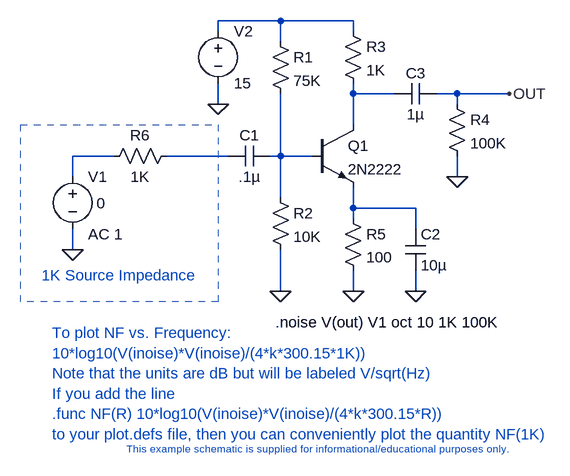
[diagram p0: schematic NoiseFigure.asc]
NoiseFigure.asc, the LTspice schematic file:
Version 4
SHEET 1 3088 1688
WIRE 1888 896 1792 896
WIRE 2000 896 1888 896
WIRE 1792 912 1792 896
WIRE 2000 912 2000 896
WIRE 1888 928 1888 896
WIRE 2000 1008 2000 992
WIRE 2064 1008 2000 1008
WIRE 2160 1008 2128 1008
WIRE 2240 1008 2160 1008
WIRE 1792 1024 1792 992
WIRE 2160 1024 2160 1008
WIRE 2000 1056 2000 1008
WIRE 1632 1104 1568 1104
WIRE 1808 1104 1712 1104
WIRE 1888 1104 1888 1008
WIRE 1888 1104 1872 1104
WIRE 1936 1104 1888 1104
WIRE 1568 1136 1568 1104
WIRE 2160 1136 2160 1104
WIRE 1888 1168 1888 1104
WIRE 2000 1184 2000 1152
WIRE 2096 1184 2000 1184
WIRE 2000 1200 2000 1184
WIRE 2096 1216 2096 1184
WIRE 1568 1248 1568 1216
WIRE 1888 1312 1888 1248
WIRE 2000 1312 2000 1280
WIRE 2096 1312 2096 1280
FLAG 1792 1024 0
FLAG 1568 1248 0
FLAG 2240 1008 OUT
FLAG 2000 1312 0
FLAG 1888 1312 0
FLAG 2096 1312 0
FLAG 2160 1136 0
SYMBOL voltage 1792 896 R0
SYMATTR InstName V2
SYMATTR Value 15
SYMBOL voltage 1568 1120 R0
WINDOW 3 37 57 Left 2
WINDOW 123 24 104 Left 2
SYMATTR Value 0
SYMATTR Value2 AC 1
SYMATTR InstName V1
SYMBOL npn 1936 1056 R0
SYMATTR InstName Q1
SYMATTR Value 2N2222
SYMBOL res 1984 896 R0
SYMATTR InstName R3
SYMATTR Value 1K
SYMBOL res 1984 1184 R0
SYMATTR InstName R5
SYMATTR Value 100
SYMBOL res 1872 912 R0
SYMATTR InstName R1
SYMATTR Value 75K
SYMBOL res 1872 1152 R0
SYMATTR InstName R2
SYMATTR Value 10K
SYMBOL cap 1872 1088 R90
WINDOW 0 0 32 VBottom 2
WINDOW 3 32 32 VTop 2
SYMATTR InstName C1
SYMATTR Value .1µ
SYMBOL cap 2080 1216 R0
SYMATTR InstName C2
SYMATTR Value 10µ
SYMBOL res 2144 1008 R0
SYMATTR InstName R4
SYMATTR Value 100K
SYMBOL cap 2128 992 R90
WINDOW 0 0 32 VBottom 2
WINDOW 3 32 32 VTop 2
SYMATTR InstName C3
SYMATTR Value 1µ
SYMBOL res 1728 1088 R90
WINDOW 0 0 56 VBottom 2
WINDOW 3 32 56 VTop 2
SYMATTR InstName R6
SYMATTR Value 1K
TEXT 1880 1360 Left 2 !.noise V(out) V1 oct 10 1K 100K
TEXT 1536 1376 Left 2 ;To plot NF vs. Frequency:\n10*log10(V(inoise)*V(inoise)/(4*k*300.15*1K))\nNote that the units are dB but will be labeled V/sqrt(Hz)\nIf you add the line\n.func NF(R) 10*log10(V(inoise)*V(inoise)/(4*k*300.15*R))\nto your plot.defs file, then you can conveniently plot the quantity NF(1K)
TEXT 1640 1272 Top 2 ;1K Source Impedance
TEXT 1936 1544 Top 1 ;This example schematic is supplied for informational/educational purposes only.
RECTANGLE Normal 1792 1328 1488 1056 2

The netlist it stands for:
* NoiseFigure.asc
V2 N001 0 15
V1 N003 0 0 AC 1
Q1 N002 N005 N006 0 2N2222
R3 N001 N002 1K
R5 N006 0 100
R1 N001 N005 75K
R2 N005 0 10K
C1 N005 N004 .1µ
C2 N006 0 10µ
R4 OUT 0 100K
C3 OUT N002 1µ
R6 N004 N003 1K
.model NPN NPN
.model PNP PNP
.lib standard.bjt
.noise V(out) V1 oct 10 1K 100K
* To plot NF vs. Frequency:
* 10*log10(V(inoise)*V(inoise)/(4*k*300.15*1K))
* Note that the units are dB but will be labeled V/sqrt(Hz)
* If you add the line
* .func NF(R) 10*log10(V(inoise)*V(inoise)/(4*k*300.15*R))
* to your plot.defs file, then you can conveniently plot the quantity NF(1K)
* 1K Source Impedance
* This example schematic is supplied for informational/educational purposes only.
.backanno
.end